# Altium schematic sheet RFID Reader 3.3V Regulator.SchDoc: Schematic
size A3; Revision: 0; SheetNumber: 3; SheetTotal: 8
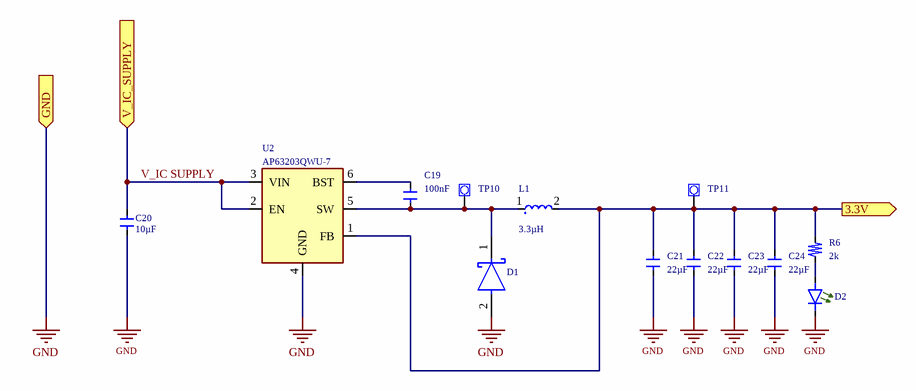
[diagram p0: RFID Reader 3.3V Regulator.SchDoc]

## Parts
?  (no value)  (graphical)
C19  value 100nF  [SYK-STD-CAP-0402 - NOSILK]  (hidden comment: SYK-CAP-GEN-0.1uF-10%-X7R-16V-0402)
C20  value 10µF  [SYK-STD-CAP-0603]  (hidden comment: SYK-CAP-GEN-10uF-10%-X5R-16V-0603)
C21  value 22µF  [SYK-STD-CAP-0603]  (hidden comment: SYK-CAP-GEN-22uF-20%-X5R-16V-0603)
C22  value 22µF  [SYK-STD-CAP-0603]  (hidden comment: SYK-CAP-GEN-22uF-20%-X5R-16V-0603)
C23  value 22µF  [SYK-STD-CAP-0603]  (hidden comment: SYK-CAP-GEN-22uF-20%-X5R-16V-0603)
C24  value 22µF  [SYK-STD-CAP-0603]  (hidden comment: SYK-CAP-GEN-22uF-20%-X5R-16V-0603)
D1  DFLS240-7  [FP-PowerDI123-MFG]  (value not drawn)
D2  APHHS1005LZGCK-V  [SYK-STD-LED-0402]  (value not drawn)
L1  value 3.3µH  [MURATA IND 1210 3225 Metric]  (hidden comment: DFE322520FD-3R3M=P2)
R6  value 2k  [SYK-STD-RES-0402]  (hidden comment: SYK-RES-GEN-2kΩ-±1%-100mW-0402)
TP10  40 mil Circular Test Point Pad  [TESTPOINT_40]  (value not drawn)
TP11  40 mil Circular Test Point Pad  [TESTPOINT_40]  (value not drawn)
U2  AP63203QWU-7  [DIODES INC TSOT26]

## Ports
3.3V (out), GND (in), V_IC_SUPPLY (in)

## Nets
GND: C20.2 C21.1 C22.1 C23.1 C24.1 D1.2(A) D2.1(K) U2.4(GND) ; port GND
3.3V: C21.2 C22.2 C23.2 C24.2 L1.2 R6.2 TP11.1(TSTPNT) U2.1(FB) ; port 3.3V
V_IC SUPPLY: C20.1 U2.2(EN) U2.3(VIN) ; port V_IC_SUPPLY
NetC19_1: C19.1 D1.1(C) L1.1 TP10.1(TSTPNT) U2.5(SW)
NetC19_2: C19.2 U2.6(BST)
NetD2_2: D2.2(A) R6.1

## Notes on the sheet
- LAYER NAME
- CRITICAL QUALITY ATTRIBUTE
- TITLE NAME
- THIS DRAWING CONTAINS CONFIDENTIAL INFORMATION AND IS ISSUED IN CONFIDENCE ON THE CONDITIONS
  THAT IT BE RETURNED ON DEMAND AND NOT BE COPIED, REPRODUCED, DISCLOSED TO OTHERS OR USED
  IN THE MANUFACTURE OF THE SUBJECT-MATTER THEREOF WITHOUT THE WRITTEN CONSENT OF
  STRYKER CORPORATION.
- SHALL BE COMPLIANT PER ES-1168 AND ES-1005
- SHEET
- OF
- NUMBER
- REV
- APPROVALS ARE FOUND IN PLM SYSTEM

## Library data of the parts
? = CMP-001-0000-v0.01.17: Stryker standard title block with pre-parameterized fields
C19 = CMP-00222-v0.01.07: Ceramic Capacitor, Multilayer, Ceramic, 16V, 10% +Tol, 10% -Tol, X7R, 15% TC, 0.1uF, Surface Mount, 0402; Manufacturer: Generic; Device Width: 220µm; Device Length: 420µm; Style Guide Revision: Librarian to Review; Operating Temperature - Min: -55°C; Ratings: -; Temperature Coefficient: X7R; Moisture Sensitivity Level: 1; Tolerance: 10%; RoHS Compliant: Yes; Pins: 2; Min Operating Temperature: -55°C; Max Operating Temperature: 125°C; Device Height: 220µm; REACH Compliant: Unknown; Critical Component: -; Mounting Technology: SMT; Operating Temperature - Max: 125°C; Capacitor Type: Ceramic; Manufacturer Part Number: Generic; Case/Package: 0402; Voltage Rating: 16V
C20 = CMP-001-00015-v0.01.02: Ceramic Capacitor, Multilayer, Ceramic, 16V, 10% +Tol, 10% -Tol, X5R, 15% TC, 10uF, Surface Mount, 0603; Manufacturer: Generic; Device Height: 800µm; Device Length: 1.6mm; Style Guide Revision: Librarian to Review; Manufacturer Part Number: Generic; REACH Compliant: Unaffected; Tolerance: 10%; Temperature Coefficient: X5R; Pins: 2; Operating Temperature - Max: 125°C; Ratings: -; Moisture Sensitivity Level: 1; Operating Temperature - Min: -55°C; Capacitor Type: Ceramic; RoHS Compliant: Yes; Voltage Rating: 16V; Mounting Technology: SMT; Case/Package: 0603; Critical Component: -; Device Width: 800µm
C21-C24 = CMP-001-00054-v0.01.02: Ceramic Capacitor, Multilayer, Ceramic, 16V, 20% +Tol, 20% -Tol, X5R, 15% TC, 22uF, Surface Mount, 0603; Manufacturer: Generic; Manufacturer Part Number: Generic; Capacitor Type: Ceramic; Height: 0.8mm; RoHS Compliant: Yes; Length: 1.6mm; Temperature Coefficient: X5R; Voltage Rating: 16V; Tolerance: 20%; Pins: 2; Width: 0.8mm; Mounting Technology: SMT; Operating Temperature - Min: -55°C; Ratings: -; Case/Package: 0603; Moisture Sensitivity Level: 1; Operating Temperature - Max: 125°C
D1 = CMP-12790-000037-1: DIODE SCHOTTKY 40V 2A POWERDI123; Manufacturer: Diodes Inc.; Peak Reverse Current: 20uA; Max Junction Temp: +125°C; Capacitance: 28pF; Max Surge Forward Current: 40A; Value: 28pF; Digikey Description: DIODE SCHOTTKY 40V 2A POWERDI123; Lead Free: Yes; Temperature Range Low: -65°C; ComponentLink2Description: Datasheet; Height: 1mm; Max Repetitive Reverse Voltage: 40V; Forward Current: 2A; Mouser Description: Schottky Diodes & Rectifiers 2.0A 40V; RoHS: TRUE; Device Class L3: Schottky Diodes; Footprint Url: https://www.diodes.com/assets/Package-Files/PowerDI123.pdf; Reverse Voltage: 40V; Package: PowerDI123; Manufacturer Part Number: DFLS240-7; Automotive: No; Device Class L1: Discrete Semiconductors; Temperature: -65°C to +125°C; Octopart: https://octopart.com/dfls240-7-diodes+inc.-9289682; Category: Diode; Temperature Range High: +125°C; ComponentLink2URL: https://www.diodes.com/assets/Package-Files/PowerDI123.pdf; Device Class L2: Diodes
D2 = CMP-001-0280-v0.01.00: LED GREEN CLEAR 2SMD; Manufacturer: Kingbright; Circuit Configuration: Independent; Style Guide Revision: Librarian to Review; Viewing Angle: 140; Lens Size - Width: 500µm; Millicandela Rating: 40mcd; Wavelength - Dominant: 525nm; Voltage - Forward (Typical): 2.65V; Lens Size - Length: 800µm; Current - Test: 2mA; Manufacturer Part Number: APHHS1005LZGCK-V; Critical Component: -; Operating Temperature - Max: 85°C; Lens Transparency: Clear; Color(s): Green; Moisture Sensitivity Level: 3; Case/Package: 0402 (1005 Metric); RoHS Compliant: Yes; Pin Count: 2; Operating Temperature - Min: -40°C; Mounting Technology: SMT; REACH Compliant: Unaffected; Data Sheet: https://www.kingbrightusa.com/images/catalog/SPEC/APHHS1005LZGCK-V.pdf
L1 = CMP-001-0306-v0.01.00: FIXED IND 3.3UH 2.3A 65 MOHM SMD; Manufacturer: Murata Electronics; Device Length: 3.2mm; Tolerance: 20%; Inductor Construction: Drum Core, Wirewound; Device Height: 2mm; DC Resistance: 65m; Device Width: 2.5mm; Style Guide Revision: Librarian to Review; Shielding: Shielded; Current - Saturation: 4.2A; Mounting Technology: SMT; Moisture Sensitivity Level: 1; RoHS Compliant: Yes; Manufacturer Part Number: DFE322520FD-3R3M=P2; Operating Temperature - Max: 125°C; Series: DFE322520FD; Critical Component: -; Operating Temperature - Min: -40°C; Case/Package: 1210 (3225 Metric); Pin Count: 2; Current - Max: 2.3A; REACH Compliant: Unaffected
R6 = CMP-009-00272-v0.01.01: Fixed Resistor, Metal Glaze/thick Film, 0.1W, 2000ohm, 50V, 1% +/-Tol, 100ppm/Cel, Surface Mount, 0402; Manufacturer: Generic; Device Length: 1mm; Device Height: 350µm; Device Width: 500µm; Temperature Coefficient: 100ppm/°C; Power: 100mW; Style Guide Revision: Librarian to Review; Pin Count: 2; Tolerance: 1%; Moisture Sensitivity Level: 1; Operating Temperature - Max: 155°C; REACH Compliant: Unaffected; Case/Package: 0402; Operating Temperature - Min: -55°C; Voltage Rating: 50V; Critical Component: -; RoHS Compliant: Yes; Manufacturer Part Number: Generic; Mounting Technology: SMT
TP10 TP11 = CMP-001-0175-v0.01.07: Manufacturer: Stryker; Manufacturer Part Number: Copper Feature; Device Width: 0mm; Plating: 0; Test Point Signal Structure: Unknown; Test Point Is Used: X; Style Guide Revision: Librarian to Review; Critical Component: -; RoHS Compliance: Unknown; Material - Insulation: 0; Operating Temperature - Max: 0°C; Color: n/a; Device Height: 0mm; Operating Temperature - Min: 0°C; Hole Diameter: 0mm; Device Length: 0mm; Device Height Above Board: 0mm; Pin Count: 1; REACH Compliance: Unknown; Material - Body: 0; Mounting Technology: SMT
U2 = CMP-001-0299-v0.01.00: Buck Switching Regulator IC Positive Fixed 3.3V 1 Output 2A SOT-23-6 Thin, TSOT-23-6; Manufacturer: Diodes Incorporated; Voltage - Supply (Max): 32V; Style Guide Revision: Librarian to Review; Device Height: 1mm; Device Width: 1.7mm; Device Length: 3mm; Voltage - Supply (Min): 3.8V; Number of Outputs: 1; Mounting Technology: SMT; Voltage - Load (Max): 3.3V; RoHS Compliant: Yes; Case/Package: SOT-23-6 Thin, TSOT-23-6; Manufacturer Part Number: AP63203QWU-7; Moisture Sensitivity Level: 1; Pin Count: 6; Current - Output: 2A; Voltage - Load (Min): 3.3V; Operating Temperature - Max: 125°C; REACH Compliance: Unaffected; Critical Component: -; Operating Temperature - Min: -40°C